# EAGLE design Bond (EAGLE 9.6.2)
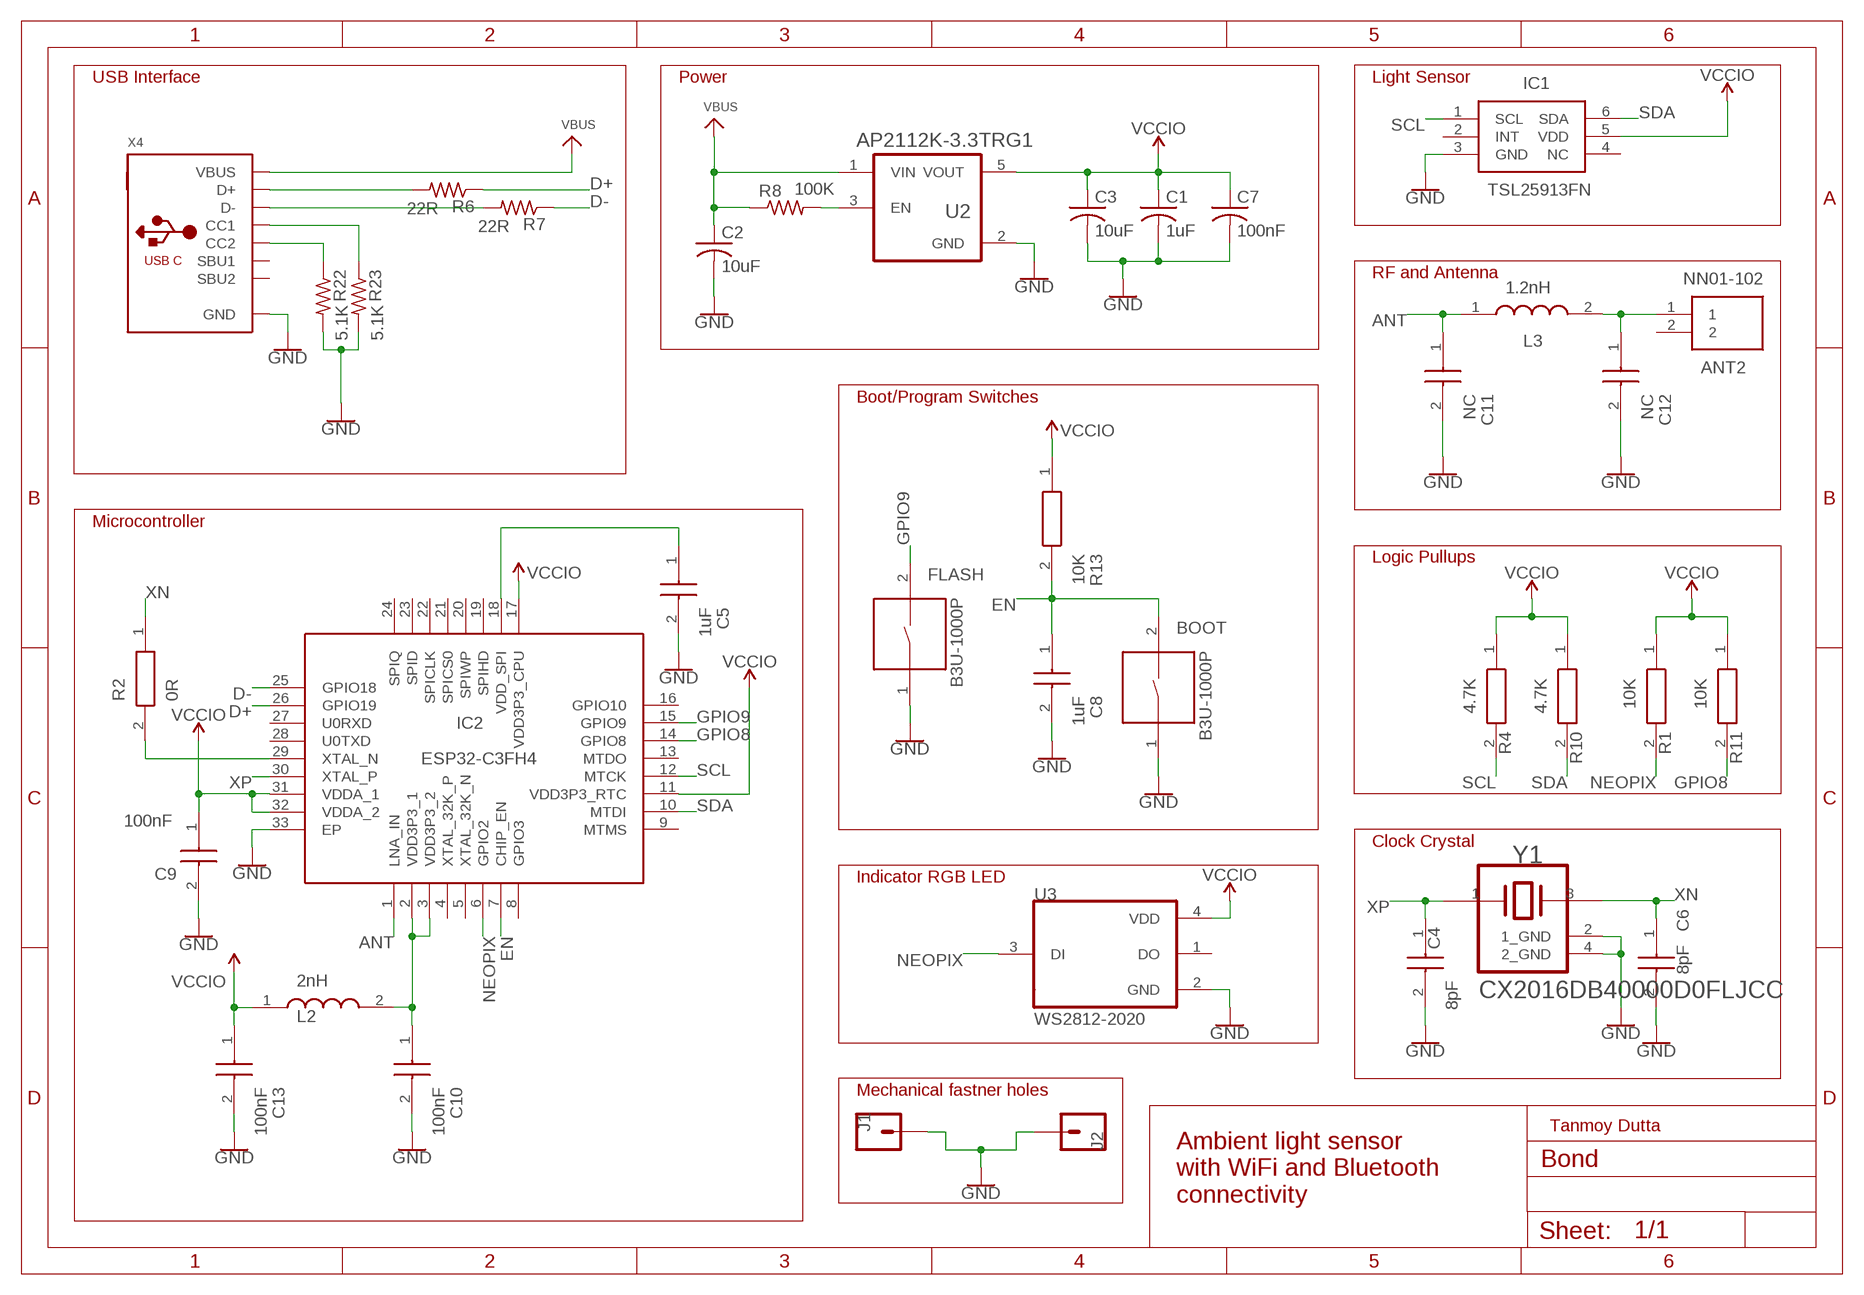
[diagram p0: schematic, sheet 1]

## Parts
ANT2  NN01-102  [NN01102]
BOOT  B3U-1000P  [SW_B3U-1000P]
C1  1uF  C-USC0402  [C0402]
C2  10uF  C-USC0402  [C0402]
C3  10uF  C-USC0402  [C0402]
C4  8pF  GJM1555C1H120JB01J  [CAPC1005X55N]
C5  1uF  GJM1555C1H120JB01J  [CAPC1005X55N]
C6  8pF  GJM1555C1H120JB01J  [CAPC1005X55N]
C7  100nF  C-USC0402  [C0402]
C8  1uF  GJM1555C1H120JB01J  [CAPC1005X55N]
C9  100nF  GJM1555C1H120JB01J  [CAPC1005X55N]
C10  100nF  GJM1555C1H120JB01J  [CAPC1005X55N]
C11  NC  GJM1555C1H120JB01J  [CAPC1005X55N]
C12  NC  GJM1555C1H120JB01J  [CAPC1005X55N]
C13  100nF  GJM1555C1H120JB01J  [CAPC1005X55N]
FLASH  B3U-1000P  [SW_B3U-1000P]
IC1  TSL25913FN  [TSL25913FN]
IC2  ESP32-C3FH4  [QFN50P500X500X90-33N]
J1  CONN_01PTH_2MM  [1X01_2MM]
J2  CONN_01PTH_2MM  [1X01_2MM]
L2  2nH  LQG15HH2N0S02D  [LQG15WH0N7B02D]
L3  1.2nH  LQW15AN1N6C0ZD  [LQW15CNR20J00B]
R1  10K  CRCW04020000Z0EE  [RESC1005X40N]
R2  0R  CRCW04020000Z0EE  [RESC1005X40N]
R4  4.7K  CRCW04020000Z0EE  [RESC1005X40N]
R6  22R  R-US_R0402  [R0402]
R7  22R  R-US_R0402  [R0402]
R8  100K  R-US_R0402  [R0402]
R10  4.7K  CRCW04020000Z0EE  [RESC1005X40N]
R11  10K  CRCW04020000Z0EE  [RESC1005X40N]
R13  10K  CRCW04020000Z0EE  [RESC1005X40N]
R22  5.1K  R-US_R0402  [R0402]
R23  5.1K  R-US_R0402  [R0402]
U2  AP2112K-3.3TRG1  [SOT95P285X140-5N]
U3  WS2812-2020  [LED_WS2812-2020]
X4  MICROBUILDER_USB_C  [MICROBUILDER_USB_C_CUSB31-CFM2AX-01-X]
Y1  40MHz  KYOCERA_INTERNATIONAL_INC._ELECTRONIC_COMPONENTS_CX2016DB40000D0FLJCCKYOCERA_INTERNATIONAL_INC._ELECTRONIC_COMPONENTS_CX2016DB40000D0FLJCC_0_0  [KYOCERA_INTERNATIONAL_INC._ELECTRONIC_COMPONENTS_CX2016DB40000D0FLJCC_0]

## Nets
ANT: C11.1 IC2.1(LNA_IN) L3.1
D+: IC2.26(GPIO19) R6.1
D-: IC2.25(GPIO18) R7.1
EN: BOOT.2 C8.1 IC2.7(CHIP_EN) R13.2
GND: BOOT.1 C1.2 C2.2 C3.2 C4.2 C5.2 C6.2 C7.2 C8.2 C9.2 C10.2 C11.2 C12.2 C13.2 FLASH.1 IC1.3(GND) IC2.33(EP) J1.1 J2.1 R22.2 R23.2 U2.2(GND) U3.2(GND) X4.A1B12(GND) X4.B1A12(GND) Y1.2(1_GND) Y1.4(2_GND)
GPIO8: IC2.14(GPIO8) R11.2
GPIO9: FLASH.2 IC2.15(GPIO9)
N$1: C5.1 IC2.18(VDD_SPI)
N$2: ANT2.1 C12.1 L3.2
N$3: C10.1 IC2.2(VDD3P3_1) IC2.3(VDD3P3_2) L2.2
N$5: IC2.29(XTAL_N) R2.2
N$7: R22.1 X4.B5(CC2)
N$9: R23.1 X4.A5(CC1)
N$12: R7.2 X4.A7(D-) X4.B7(D-)
N$13: R6.2 X4.A6(D+) X4.B6(D+)
N$23: R8.2 U2.3(EN)
NEOPIX: IC2.6(GPIO2) R1.2 U3.3(DI)
SCL: IC1.1(SCL) IC2.12(MTCK) R4.2
SDA: IC1.6(SDA) IC2.10(MTDI) R10.2
VBUS: C2.1 R8.1 U2.1(VIN) X4.A4B9(VBUS) X4.B4A9(VBUS)
VCCIO: C1.1 C3.1 C7.1 C9.1 C13.1 IC1.5(VDD) IC2.11(VDD3P3_RTC) IC2.17(VDD3P3_CPU) IC2.31(VDDA_1) IC2.32(VDDA_2) L2.1 R1.1 R4.1 R10.1 R11.1 R13.1 U2.5(VOUT) U3.4(VDD)
XN: C6.1 R2.1 Y1.3
XP: C4.1 IC2.30(XTAL_P) Y1.1
Unconnected: ANT2.2 IC1.2(INT) IC1.4(NC) IC2.4(XTAL_32K_P) IC2.5(XTAL_32K_N) IC2.8(GPIO3) IC2.9(MTMS) IC2.13(MTDO) IC2.16(GPIO10) IC2.19(SPIHD) IC2.20(SPIWP) IC2.21(SPICS0) IC2.22(SPICLK) IC2.23(SPID) IC2.24(SPIQ) IC2.27(U0RXD) IC2.28(U0TXD) U3.1(DO) X4.A8(SBU1) X4.B8(SBU2)

## Notes on the sheet
- USB Interface | Power | Light Sensor
- RF and Antenna
- Boot/Program Switches
- Microcontroller
- Logic Pullups
- Clock Crystal
- Indicator RGB LED
- Mechanical fastner holes
- Tanmoy Dutta
- Ambient light sensor 
  with WiFi and Bluetooth 
  connectivity

## Library data of the parts
ANT2 = NN01-102:NN01-102: Antennas Compact Reach Xtend 2.4 GHz please refer here for design assistance at http://fractusantennas.com/fast-track-project/ Source: Datasheet <https://ignion.io/files/UM_NN01-102.pdf>; DESCRIPTION: Antennas Compact Reach Xtend 2.4 GHz please refer here for design assistance at http://fractusantennas.com/fast-track-project/; HEIGHT: 2.2mm; MANUFACTURER_NAME: Ignion; MANUFACTURER_PART_NUMBER: NN01-102; MOUSER_PART_NUMBER: 128-NN01-102; MOUSER_PRICE-STOCK: https://www.mouser.co.uk/ProductDetail/Ignion/NN01-102?qs=bAKSY%2FctAC74AFavC%252BjOHQ%3D%3D
BOOT FLASH = B3U-1000P:B3U-1000P: Switch Tactile N.O. SPST Round Button Gull Wing 0.05A 12VDC 1.5N SMD Embossed T/R; AVAILABILITY: Unavailable; DESCRIPTION: Switch Tactile N.O. SPST Round Button Gull Wing 0.05A 12VDC 1.5N SMD Embossed T/R; MF: Omron; MP: B3U-1000P; PACKAGE: None; PRICE: None
C1-C3 C7 = adafruit:C-US: CAPACITOR, American symbol; SPICEPREFIX: C
C4-C6 C8-C13 = GJM1555C1H120JB01J-12pF0402:GJM1555C1H120JB01J: Capacitor GJM15_0.10 L=1.0mm W=0.5mm T=0.5mm Source: Datasheet <https://psearch.en.murata.com/capacitor/product/GJM1555C1H120JB01#.html>; DESCRIPTION: Capacitor GJM15_0.10 L=1.0mm W=0.5mm T=0.5mm; HEIGHT: 0.55mm; MANUFACTURER_NAME: Murata Electronics; MANUFACTURER_PART_NUMBER: GJM1555C1H120JB01J; MOUSER_PART_NUMBER: 81-GJM1555C1H120JB1J; MOUSER_PRICE-STOCK: https://www.mouser.co.uk/ProductDetail/Murata-Electronics/GJM1555C1H120JB01J?qs=563MOeNa05LNM%252BoI0iguJA%3D%3D
IC1 = TSL25913FN:TSL25913FN: Light to Digital Ambient Light Sensor Digital 3V 6-Pin DFN EP Source: Datasheet <https://componentsearchengine.com/Datasheets/1/TSL25913FN.pdf>; DESCRIPTION: Light to Digital Ambient Light Sensor Digital 3V 6-Pin DFN EP; HEIGHT: 1.15mm; MANUFACTURER_NAME: ams; MANUFACTURER_PART_NUMBER: TSL25913FN; MOUSER_PART_NUMBER: 985-TSL25913FN; MOUSER_PRICE-STOCK: https://www.mouser.com/Search/Refine.aspx?Keyword=985-TSL25913FN; SPICEPREFIX: X
IC2 = ESP32-C3FH4 2:ESP32-C3FH4: RF System on a Chip - SoC SMD IC ESP32-C3FH4, single-core MCU, 2.4G Wi-Fi & BLE 5.0 combo, QFN 32-pin, 5*5 mm, 4 MB flash inside, -40C +105C Source: Datasheet <https://www.espressif.com/sites/default/files/documentation/esp32-c3_datasheet_en.pdf>; DESCRIPTION: RF System on a Chip - SoC SMD IC ESP32-C3FH4, single-core MCU, 2.4G Wi-Fi & BLE 5.0 combo, QFN 32-pin, 5*5 mm, 4 MB flash inside, -40C +105C; HEIGHT: 0.9mm; MANUFACTURER_NAME: Espressif Systems; MANUFACTURER_PART_NUMBER: ESP32-C3FH4; MOUSER_PART_NUMBER: 356-ESP32-C3FH4; MOUSER_PRICE-STOCK: https://www.mouser.co.uk/ProductDetail/Espressif-Systems/ESP32-C3FH4?qs=iLbezkQI%252BsgL5PSvEueYlQ%3D%3D
J1 J2 = SparkFun-Connectors:CONN_01: Single connection point. Often used as Generic Header-pin footprint for 0.1 inch spaced/style header connections On any of the 0.1 inch spaced packages, you can populate with these: Break Away Headers - Straight <https://www.sparkfun.com/products/116> (PRT-00116) Break Away Male Headers - Right Angle <https://www.sparkfun.com/products/553> (PRT-00553) Female Headers <https://www.sparkfun.com/products/115> (PRT-00115) Break Away Headers - Machine Pin <https://www.sparkfun.com/products/117> (PRT-00117) Break Away Female Headers - Swiss Machine Pin <https://www.sparkfun.com/products/743> (PRT-00743) This device is also useful as a general connection point to wire up your design to another part of your project. Our various solder wires solder well into these plated through hole pads. Hook-Up Wire - Assortment (Stranded, 22 AWG) <https://www.sparkfun.com/products/11375> (PRT-11375) Hook-Up Wire - Assortment (Solid Core, 22 AWG) <https://www.sparkfun.com/products/11367> (PRT-11367) View the entire wire category on our website here <https://www.sparkfun.com/categories/141> Special notes: SMTSO-256-ET is a "flush mount" nut for a 4-40 screw. We mostly use this on specialty testbeds; it is a nice way to connect hardware to your PCB at an adjustable hieght. Also note, the SNAP packages are for using a snappable style connector. We sell a baggie of snaps and they are also used on two LilyPad designs: Snap Assortment - 30 pack (male and female) <https://www.sparkfun.com/products/11347> (DEV-11347) LilyPad Arduino SimpleSnap <https://www.sparkfun.com/products/10941> (DEV-10941) LilyPad SimpleSnap Protoboard <https://www.sparkfun.com/products/10940> (DEV-10940)
L2 = LQG15HH2N0S02D-2nH0402:LQG15HH2N0S02D: LQG15HH_02 Series Inductor 2.0nH +/-0.3nH 0402 (1005) Source: Datasheet <https://psearch.en.murata.com/inductor/product/LQG15HH2N0S02#.html>; ARROW_PART_NUMBER: LQG15HH2N0S02D; ARROW_PRICE-STOCK: https://www.arrow.com/en/products/lqg15hh2n0s02d/murata-manufacturing; DESCRIPTION: LQG15HH_02 Series Inductor 2.0nH +/-0.3nH 0402 (1005); HEIGHT: 0.55mm; MANUFACTURER_NAME: Murata Electronics; MANUFACTURER_PART_NUMBER: LQG15HH2N0S02D; MOUSER_PART_NUMBER: 81-LQG15HH2N0S02D; MOUSER_PRICE-STOCK: https://www.mouser.co.uk/ProductDetail/Murata-Electronics/LQG15HH2N0S02D?qs=%2F%252BYoplLUB5jlvx4879j00w%3D%3D
L3 = LQW15AN1N6C0ZD-1.6nH-0402:LQW15AN1N6C0ZD: LQW15AN_0Z Series Inductor 1.6nH +/-0.2nH 0402 (1005) Source: Datasheet <https://psearch.en.murata.com/inductor/product/LQW15AN1N6C0Z#.html>; DESCRIPTION: LQW15AN_0Z Series Inductor 1.6nH +/-0.2nH 0402 (1005); HEIGHT: 0.6mm; MANUFACTURER_NAME: Murata Electronics; MANUFACTURER_PART_NUMBER: LQW15AN1N6C0ZD
R1 R2 R4 R10 R11 R13 = Generic-0R-0402:CRCW04020000Z0EE: Standard Thick Film Chip Resistors value 0000 ohm. Source: Datasheet <http://www.vishay.com/docs/20035/dcrcwe3.pdf>; ARROW_PART_NUMBER: CRCW04020000Z0EE; ARROW_PRICE-STOCK: https://www.arrow.com/en/products/crcw04020000z0ee/vishay; DESCRIPTION: Standard Thick Film Chip Resistors value 0000 ohm.; HEIGHT: 0.4mm; MANUFACTURER_NAME: Vishay; MANUFACTURER_PART_NUMBER: CRCW04020000Z0EE; MOUSER_PART_NUMBER: 71-CRCW04020000Z0EE; MOUSER_PRICE-STOCK: https://www.mouser.co.uk/ProductDetail/Vishay-Dale/CRCW04020000Z0EE?qs=3qWEzBg5KnL4Q%252BFlMMG30A%3D%3D
R6-R8 R22 R23 = adafruit:R-US_: RESISTOR, American symbol; SPICEPREFIX: R
U2 = AP2112K-3.3TRG1:AP2112K-3.3TRG1: AP2112 Series 0.6 A 3.3 V Fixed Output SMT LDO Linear Regulator - SOT23-5; AVAILABILITY: Unavailable; DESCRIPTION: AP2112 Series 0.6 A 3.3 V Fixed Output SMT LDO Linear Regulator - SOT23-5; MF: Diodes Inc.; MP: AP2112K-3.3TRG1; PACKAGE: SOT-753 Diodes Inc.; PRICE: None; SPICEPREFIX: E
U3 = WS2812-2020:WS2812-2020: Intelligent control LED integrated light source Check availability <https://pricing.snapeda.com/parts/WS2812-2020/Worldsemi/view-part?ref=eda>; AVAILABILITY: Not in stock; DESCRIPTION: Intelligent control LED light source, SMD-4; MF: Worldsemi; MP: WS2812-2020; PACKAGE: Package; PRICE: None
X4 = Adafruit Feather STM32F405 Express:MICROBUILDER_USB_C: USB Type-C USB 2.0 Connector; SPICEPREFIX: X
Y1 = Kyocera International Inc. Electronic Components - CX2016DB40000D0FLJCC:KYOCERA_INTERNATIONAL_INC._ELECTRONIC_COMPONENTS_CX2016DB40000D0FLJCC: CRYSTAL 40.0000MHZ 8PF SMD; AUTOMOTIVE: No; CENTROID_NOT_SPECIFIED: No; DATASHEET: https://global.kyocera.com/prdct/electro/product/pdf/cx2016db_e.pdf; DEVICE_CLASS_L1: Passive Components; DEVICE_CLASS_L2: Crystals / Oscillators; DEVICE_CLASS_L3: Crystals; DIGIKEY_DESCRIPTION: CRYSTAL 40.0000MHZ 8PF SMD; DIGIKEY_PART_NUMBER: 1253-1120-1-ND; ESR: 50Ω; FOOTPRINT_VARIANT_NAME_0: Recommended_Land_Pattern; FREQUENCY: 40MHz; HEIGHT: 0.45mm; LEAD_FREE: Yes; LOAD_CAPACITANCE: 8pF; MF: Kyocera International Inc. Electronic Components; MFG_PACKAGE_IDENT: CX2016DB; MFG_PACKAGE_IDENT_DATE: 0; MFG_PACKAGE_IDENT_REV: 0; MOUSER_DESCRIPTION: Crystal 40MHz 8pF 4-Pin SMD T/R; MOUSER_PART_NUMBER: 581-CX2016DB40DFLJCC; MPN: CX2016DB40000D0FLJCC; PACKAGE: SMT_2MM0_1MM6; PREFIX: Y; ROHS: Yes; SERIES: CX2016DB; STABILITY: 15ppm; TEMPERATURE_RANGE_HIGH: +85°C; TEMPERATURE_RANGE_LOW: -30°C; TOLERANCE: 15ppm; VERIFICATION_VERSION: 0.0.0.2

## Board
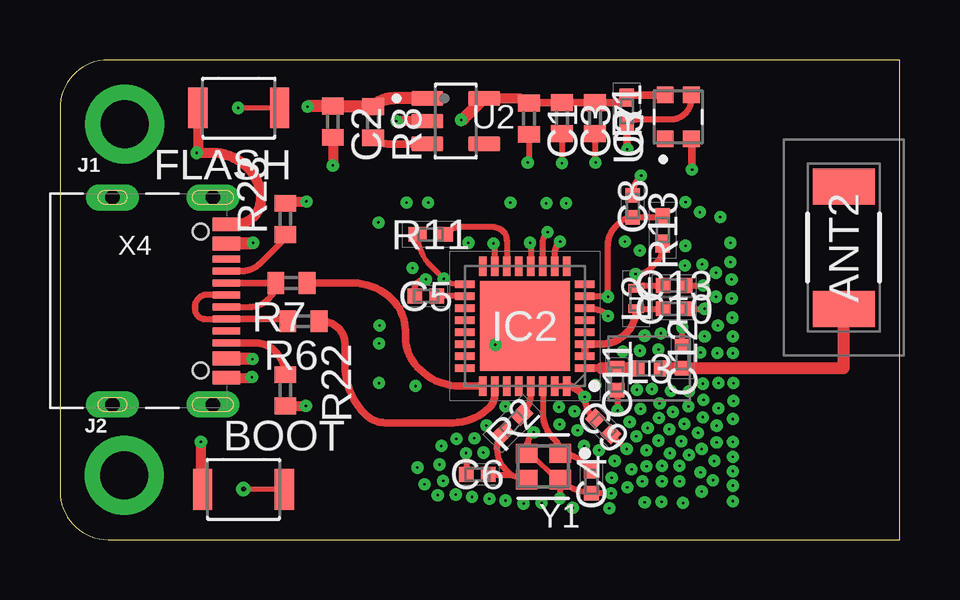
[diagram p1: board, top side]
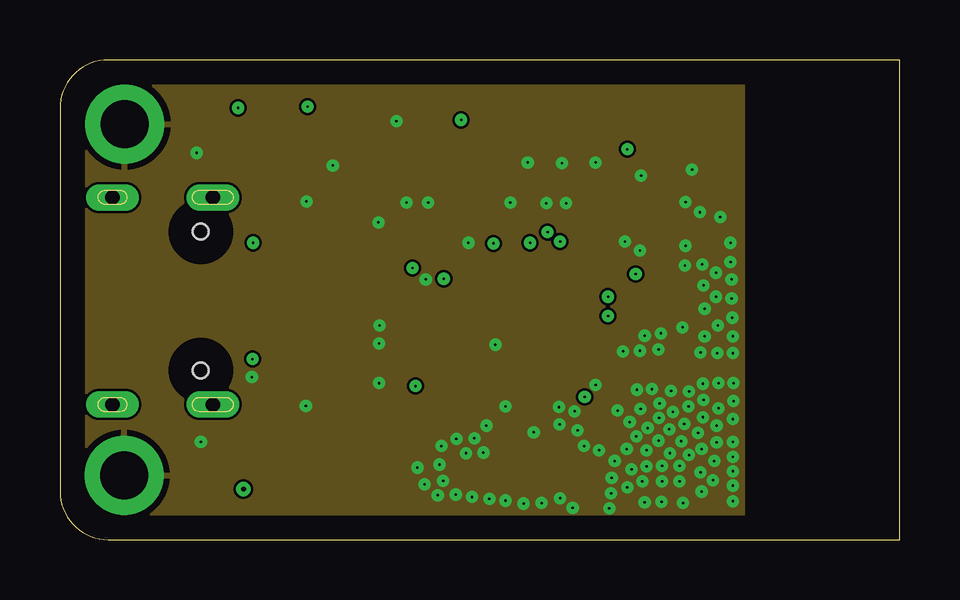
[diagram p2: board, inner layer Route2]
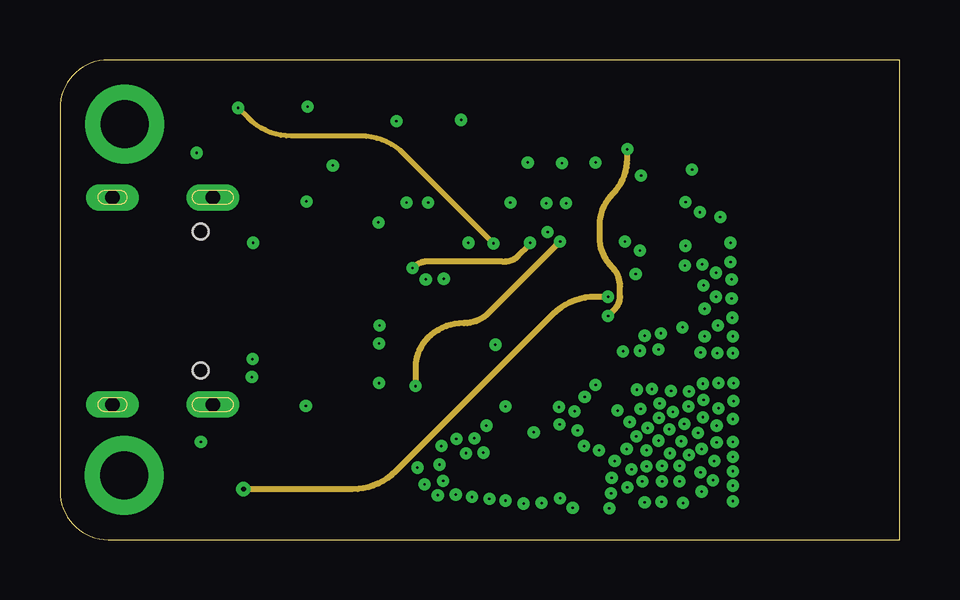
[diagram p3: board, inner layer Route15]
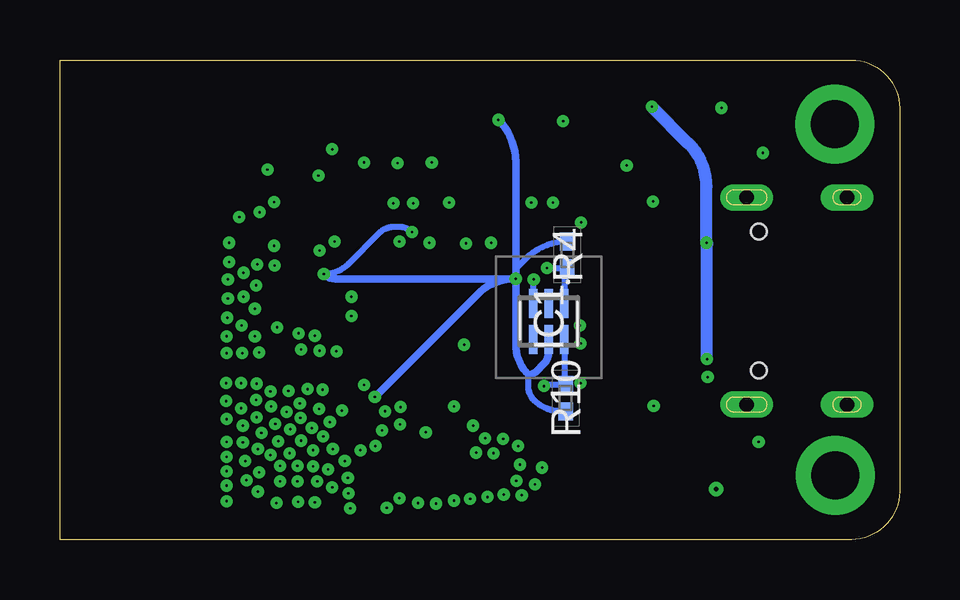
[diagram p4: board, bottom side, seen from below]

Size 35 x 20 mm. Coordinates in mm from the lower left corner, seen from the top.
Outline: 2,0 35,0 35,20 2,20 arc90 0,18 0,2 arc90 2,0
Copper layers (1+2*15+16): Top 0.035mm / dielectric 1.5mm / Route2 0.035mm / dielectric 0.15mm / Route15 0.035mm / dielectric 0.2mm / Bottom 0.035mm
Design rules "default *": minimum track width 4mil, minimum drill 0.2mm, track to track 4mil, track to pad 4mil, pad to pad 4mil, via to via 4mil, smd to smd 4mil, copper to edge 40mil, drill to drill 4mil, minimum pad ring 10mil, minimum via ring 8mil, stop-mask expansion 4mil, vias tented up to drill 0mil, thermal gap 10mil

### Footprints (pad centres in the part's own frame; a part is rotated, then mirrored left to right if it is on the bottom)
NN01102 = smd 1.5 x 2.6: 1 -2.55,0; 2 2.55,0
SW_B3U-1000P = smd 0.8 x 1.7: 1 -1.7,0; 2 1.7,0
C0402 = smd 0.7 x 0.9: 1 -0.65,0; 2 0.65,0
CAPC1005X55N = smd 0.6 x 0.62: 1 -0.46,0; 2 0.46,0
TSL25913FN = smd 1.2 x 0.35: 1 -0.75,0.65; 2 -0.75,0; 3 -0.75,-0.65; 4 0.75,-0.65; 5 0.75,0; 6 0.75,0.65
QFN50P500X500X90-33N = smd 0.8 x 0.3: 1 -2.5,1.75; 2 -2.5,1.25; 3 -2.5,0.75; 4 -2.5,0.25; 5 -2.5,-0.25; 6 -2.5,-0.75; 7 -2.5,-1.25; 8 -2.5,-1.75; 17 2.5,-1.75; 18 2.5,-1.25; 19 2.5,-0.75; 20 2.5,-0.25; 21 2.5,0.25; 22 2.5,0.75; 23 2.5,1.25; 24 2.5,1.75 | smd 0.3 x 0.8: 9 -1.75,-2.5; 10 -1.25,-2.5; 11 -0.75,-2.5; 12 -0.25,-2.5; 13 0.25,-2.5; 14 0.75,-2.5; 15 1.25,-2.5; 16 1.75,-2.5; 25 1.75,2.5; 26 1.25,2.5; 27 0.75,2.5; 28 0.25,2.5; 29 -0.25,2.5; 30 -0.75,2.5; 31 -1.25,2.5; 32 -1.75,2.5 | smd 3.75 x 3.75: 33 0,0
1X01_2MM = drill 2 pad 3.302: 1 0,0
LQG15WH0N7B02D = smd 0.35 x 0.65: 1 -0.425,0; 2 0.425,0
LQW15CNR20J00B = smd 0.5 x 0.66: 1 -0.45,0; 2 0.45,0
RESC1005X40N = smd 0.75 x 0.6: 1 -0.55,0; 2 0.55,0
R0402 = smd 0.7 x 0.9: 1 -0.65,0; 2 0.65,0
SOT95P285X140-5N = smd 1.35 x 0.6: 1 -1.185,0.95; 2 -1.185,0; 3 -1.185,-0.95; 4 1.185,-0.95; 5 1.185,0.95
LED_WS2812-2020 = smd 0.7 x 0.7: 1 -0.915,0.55; 2 -0.915,-0.55; 3 0.915,-0.55; 4 0.915,0.55
MICROBUILDER_USB_C_CUSB31-CFM2AX-01-X = smd 0.575 x 1.15: A1B12 -3.2,3.545; A4B9 -2.4,3.545; B1A12 3.2,3.545; B4A9 2.4,3.545 | smd 0.275 x 1.15: A5 -1.25,3.545; A6 -0.25,3.545; A7 0.25,3.545; A8 1.25,3.545; B5 1.75,3.545; B6 0.75,3.545; B7 -0.75,3.545; B8 -1.75,3.545 | drill 0.6 pad 1 long: M1 -4.32,2.97; M2 4.32,2.97; M3 -4.32,-1.21; M4 4.32,-1.21 | hole 0.65: 2.89,2.47; -2.89,2.47
KYOCERA_INTERNATIONAL_INC._ELECTRONIC_COMPONENTS_CX2016DB40000D0FLJCC_0 = smd 0.9 x 0.8: 1 -0.7,-0.55; 2 0.7,-0.55; 3 0.7,0.55; 4 -0.7,0.55

### Placement (x,y rotation side)
ANT2  32.67,12.18 90 top
BOOT  7.65,2.1 0 top
C1  19.55,17.55 270 top
C2  11.38,17.43 270 top
C3  20.93,17.57 270 top
C4  22.15,2.4 270 top
C5  15.25,10.15 180 top
C6  17.4,2.73 180 top
C7  22.3,17.57 270 top
C8  23.88,13.9 90 top
C9  22.64,4.72 315 top
C10  25.6,9.62 0 top
C11  23.23,6.68 270 top
C12  25.95,7.61 90 top
C13  25.6,10.6 0 top
FLASH  7.45,18 0 top
IC1  14.62,9.1 270 bottom
IC2  19.38,8.9 180 top
J1  2.7,17.32 0 top
J2  2.67,2.67 0 top
L2  24.02,10.05 270 top
L3  24.57,7.14 0 top
R1  23.62,17.88 270 top
R2  18.86,4.83 45 top
R4  13.85,11.88 270 bottom
R6  10.15,9.1 180 top
R7  9.65,10.7 180 top
R8  13.05,17.4 270 top
R10  13.93,5.9 90 bottom
R11  15.45,12.72 0 top
R13  25.12,12.9 90 top
R22  9.4,6.22 270 top
R23  9.4,13.38 90 top
U2  16.5,17.45 0 top
U3  25.77,17.62 90 top
X4  3.4,9.95 270 top
Y1  20.15,3.05 180 top

### Tracks (layer width: path | path; a pad name or v marks a point on that pad's centre or on a via)
ANT
  Top 0.305: IC2.1 22.57,7.15
  Top 0.5: 22.57,7.15 C11.1 L3.1
D+
  Top 0.254: R6.1 10.9,9
  Top 0.305: R6.1 10.9,9.1 arc-45 11.62,8.8 arc-45 11.88,8.2 11.88,7.28 arc45 12.73,5.22 arc45 13.55,4.88 16.38,4.88 arc45 17.9,5.5 arc45 18.12,6.05 IC2.26
D-
  Top 0.305: R7.1 12.19,10.7 arc-45 13.85,10.01 arc-45 14.4,8.69 14.4,8.43 arc45 14.91,7.19 15,7.1 arc45 16.69,6.4 IC2.25
EN  (via drill 0.1, 0.2)
  Top 0.203: BOOT.2 v7.65,2.1
  Top 0.254: IC2.7 22.79,10.15 arc-45 v22.85,10.12 22.85,12.3 arc-45 23.17,13.07 23.3,13.2 arc-45 C8.1 arc-45 23.9,13.45 R13.2
  Route15 0.254: v22.85,10.12 22.33,10.12 arc45 20.53,9.38 13.99,2.84 arc-45 12.2,2.1 v7.65,2.1
GND  (via drill 0.1)
  Top 0.203: Y1.2 arc-45 19.75,3.48 20.64,2.59 arc45 Y1.4 | IC2.33 18.92,8.44 arc-45 v18.15,8.12
  Top 0.254: v16.93,3.6 16.94,3.58 C6.2 | v20.85,1.73 Y1.4 arc45 22.11,1.98 C4.2 22.96,1.94 v22.98,1.93 | C1.2 19.55,15.85 arc-45 v19.5,15.72 | C3.2 v20.93,15.7 | C7.2 22.3,15.79 arc45 v22.32,15.72 | C5.2 14.79,10.46 arc-45 14.89,10.7 arc-45 v15.25,10.85 | v23.62,3.77 23.59,3.77 C9.2 | C10.2 v26.88,9.62 | C13.2 v26.82,10.6 | C8.2 arc-45 24.2,15.15 v24.23,15.18 | C12.2 v25.95,8.85 arc45 v25.95,8.85 | C11.2 arc-45 23.24,6.18 v23.24,5.38 | v19.75,4.47 arc45 19.45,3.75 Y1.2
  Top 0.305: U3.2 arc-45 26.35,16.65 v26.35,15.43
  Top 0.406: U2.2 v14.03,17.45 | C2.2 v11.38,15.6 | R23.2 arc-45 9.58,14.1 v10.28,14.1 | R22.2 v10.25,5.58 | X4.B1A12 7.94,6.75 arc45 v8,6.78 | X4.A1B12 7.33,13.15 arc45 8.07,13.46 arc45 8.38,14.21 arc45 7.85,15.49 arc45 6.32,16.12 v5.7,16.12 arc45 5.75,16.25 FLASH.1 | BOOT.1 arc-45 5.88,2.28 v5.88,4.08
  Bottom 0.254: IC1.3 15.28,10.82 v15.25,10.85
  other vias: 17.02,12.38 25.82,2.42 24.05,6.25 26.23,6.17 28.05,4.08 24.02,4.3 27.45,6.53 24.98,5.08 22.32,6.45 23.48,7.85 25.48,6.2 25,5.67 25.05,8.6 24.18,7.88 27.4,7.78 26.7,7.8 25.55,5.33 26.75,3.77 26.7,2.8 26.75,2 25.98,1.52 25.07,1.57 27.52,13.45 26.68,13.65 26.07,14.07 23.55,12.43 24.18,12.05 21.1,14.03 20.27,14.03 18.77,14.05 15.35,14.05 14.45,14.05 13.28,13.22 13.32,8.93 13.3,8.18 13.3,6.53 15.75,1.85 14.9,3 17.9,1.7 15.2,2.3 19.32,1.5 20.07,1.52 24.38,1.55 26.8,6.5 23.65,2.17 24.45,3.73 25.43,3.6 25.1,3.08 22.48,3.73 23.75,4.9 25.4,4.6 23.82,2.92 28.07,5.78 24.27,2.42 28.07,6.53 26.88,8.47 28.05,7.78 28.05,8.47 28.02,9.25 28.05,3.45 28.05,2.85 28.05,2.25 28.05,1.6 28,10.05 28,10.85 27.95,11.57 27.95,12.38 20.8,5.53 21.85,3.9 17.77,4.75 18.57,5.55 18.57,1.62 17.65,3.62 23.12,3.27 21.45,5.35 24.95,7.92 24.5,4.65 27.43,8.93 26.05,11.43 27.45,5.47 26.2,5.55 24.68,6.28 24.45,3.05 25.1,2.42 25.9,4.1 16.5,1.88 17.18,1.77 15.82,3.12 15.97,2.45 15.9,3.9 25.82,3.08 24.38,8.5 26.82,5.83 26.02,4.83 24.95,4.12 26.8,5.1 26.6,4.45 27.38,4.75 27.35,10.12 27.35,11.12 26.77,11.47 26.07,12.25 26.23,3.52 27.38,4.05 28.05,5.03 21.57,4.55 20.82,4.8 23,2.58 24.2,5.45 17.27,4.22 16.52,4.2 27.27,3.27 27.23,2.48 21.38,1.32 22.9,1.3
  pour Route2: 28.5,19.75 2.25,19.75 arc90 0.25,17.75 0.25,2.25 arc90 2.25,0.25 28.5,0.25
GPIO8
  Top 0.254: R11.2 arc-45 16.79,13.05 17.99,13.05 arc-45 18.48,12.85 arc-45 18.62,12.49 IC2.14
GPIO9  (via drill 0.1)
  Top 0.203: FLASH.2 v7.42,18
  Top 0.254: IC2.15 18.12,12.23 arc45 v18.07,12.35
  Route15 0.203: v18.07,12.35 14.34,16.08 arc45 12.55,16.82 9.65,16.82 arc-45 7.86,17.57 v7.42,18
N$1
  Top 0.254: IC2.18 C5.1
N$2
  Top 0.5: L3.2 25.04,7.15 C12.1 32.67,7.15 ANT2.1
N$3
  Top 0.254: L2.2 C10.1
  Top 0.305: IC2.2 IC2.3 22.54,8.15 arc45 23.59,8.59 arc45 L2.2
N$5
  Top 0.254: IC2.29 19.62,6.11 arc-45 R2.2
N$7
  Top 0.305: X4.B5 8.18,8.2 arc-45 8.9,7.9 9.03,7.77 arc-45 R22.1
N$9
  Top 0.27: X4.A5 7.6,11.2 arc45 8.32,11.5 9.29,12.47 arc45 R23.1
N$12
  Top 0.254: X4.A7 7.93,9.7 arc45 8.65,10 8.75,10.1 arc45 R7.2
  Top 0.27: X4.B7 R7.2
N$13
  Top 0.254: X4.A6 6.07,10.2 arc45 5.83,10.1 5.77,10.04 arc45 5.62,9.7 5.62,9.66 arc45 5.78,9.3 arc45 6.02,9.2 X4.B6
  Top 0.27: X4.B6 9.26,9.2 arc-45 R6.2
N$23
  Top 0.305: U2.3 13.65,16.5 arc-45 R8.2
NEOPIX  (via drill 0.1)
  Top 0.254: IC2.6 22.07,9.65 arc-45 v22.85,9.32 | R1.2 arc-45 24.11,17.52 25.47,17.52 arc45 26.07,17.77 arc45 26.32,18.38 U3.3
  Top 0.305: R1.2 23.62,16.34 arc45 v23.65,16.27
  Route15 0.254: v22.85,9.32 23.12,9.6 arc45 23.35,10.15 23.35,10.56 arc45 23.02,11.35 arc-45 22.5,12.62 22.5,13.1 arc-45 23.05,14.43 arc45 23.65,15.87 v23.65,16.27
SCL  (via drill 0.1)
  Top 0.254: IC2.12 19.62,12.35 v19.6,12.38
  Route15 0.254: 18.57,11.6 18.56,11.6 | v14.7,11.32 arc-45 15.36,11.6 18.43,11.6 18.56,11.6 | 18.56,11.6 arc45 19.1,11.82 19.57,12.29 arc45 v19.6,12.38
  Bottom 0.254: IC1.1 13.97,11.02 arc45 R4.2 v14.7,11.32
SDA  (via drill 0.1)
  Top 0.254: IC2.10 20.62,11.88 arc-45 v20.85,12.43
  Route15 0.254: v20.85,12.43 17.87,9.45 arc-45 16.85,9.03 16.83,9.03 arc45 15.32,8.4 arc45 14.82,7.19 v14.82,6.4
  Bottom 0.254: IC1.6 13.97,6.5 R10.2 14.7,6.45 arc-45 v14.82,6.4
VBUS  (via drill 0.1)
  Top 0.508: X4.B4A9 8,7.55 v8.03,7.53 | U2.1 13.89,18.4 arc45 R8.1 11.44,18.05 arc-45 C2.1 10.38,18.07 arc45 v10.32,18.05 | X4.A4B9 arc-45 7,12.38 v8.05,12.38
  Bottom 0.508: v8.03,7.53 8.03,12.31 arc-45 v8.05,12.38 8.05,14.72 arc-45 8.79,16.52 v10.32,18.05
VCCIO  (via drill 0.1)
  Top 0.203: IC2.17 16.54,10.65 arc-45 v16,10.88 15.43,11.45 arc-45 R11.1
  Top 0.254: IC2.31 IC2.32 | v24,11.07 24.02,11.05 | 24.02,11.05 L2.1 arc-45 24.33,10.6 C13.1 | IC2.11 20.12,12.34 arc-45 v20.32,12.82 | R13.1 25.12,12.19 arc-45 24.85,11.53 24.62,11.3 arc-45 24.02,11.05 | v21.88,5.95 arc45 22.25,5.04 C9.1
  Top 0.305: IC2.32 arc-45 21.64,6.19 v21.88,5.95 | 23.5,18.43 R1.1 | 19.57,18.23 C3.1 C7.1 23.14,18.23 arc45 R1.1 | R1.1 arc-45 23.9,18.54 U3.4
  Top 0.406: U2.5 19.07,18.4 arc-45 C1.1 19.57,18.23
  Top 0.508: U2.5 16.83,17.54 arc-45 v16.73,17.5
  Bottom 0.254: 14.14,5.35 arc45 15.22,5.8 arc45 15.47,6.41 15.47,6.88 | R4.1 arc-45 15.6,11.7 16,11.3 | v24,11.07 arc-45 22.98,11.5 21.69,12.79 arc45 21.05,13.05 20.87,13.05 arc45 v20.32,12.82
  Bottom 0.305: v21.88,5.95 17.62,10.2 arc45 v16,10.88 | v16,10.88 16,11.3 16,15.75 arc-45 v16.73,17.5 | v16,10.88 | R10.1 14.14,5.35 | IC1.5 14.62,7.82 arc45 14.84,7.31 15.13,7.02 arc45 15.47,6.88 arc45 16,8.14 v16,10.88 | v16,10.88 23.52,10.88 arc45 v24,11.07
XN
  Top 0.254: R2.1 arc45 18.23,3.83 18.23,3.73 arc45 18.55,2.95 18.81,2.69 18.86,2.67 | 18.86,2.67 18.98,2.62 19.04,2.62 19.33,2.5 arc45 Y1.3 | C6.1 17.92,2.67 18.86,2.67
XP
  Top 0.254: IC2.30 20.12,5.28 arc45 20.55,4.25 20.6,4.2 arc-45 Y1.1 arc-45 21.81,3.2 C4.1